# EAGLE design kirchhoff (EAGLE 9.6.2)
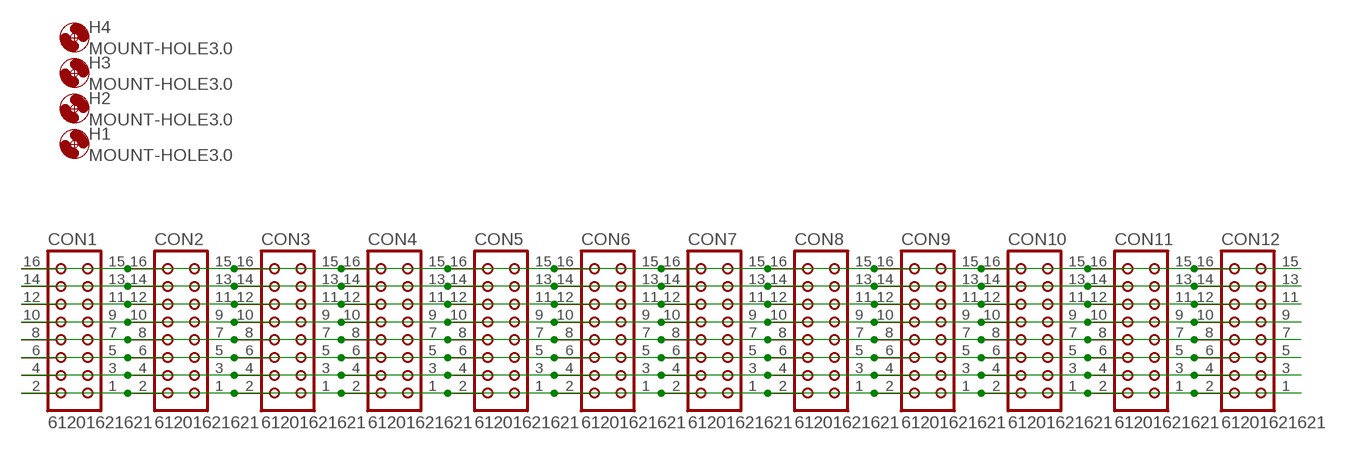
[diagram p0: schematic, sheet 1]

## Parts
CON1  61201621621  CON16L  [CON16L]
CON2  61201621621  CON16L  [CON16L]
CON3  61201621621  CON16L  [CON16L]
CON4  61201621621  CON16L  [CON16L]
CON5  61201621621  CON16L  [CON16L]
CON6  61201621621  CON16L  [CON16L]
CON7  61201621621  CON16L  [CON16L]
CON8  61201621621  CON16L  [CON16L]
CON9  61201621621  CON16L  [CON16L]
CON10  61201621621  CON16L  [CON16L]
CON11  61201621621  CON16L  [CON16L]
CON12  61201621621  CON16L  [CON16L]
H1  MOUNT-HOLE3.0  [3,0]
H2  MOUNT-HOLE3.0  [3,0]
H3  MOUNT-HOLE3.0  [3,0]
H4  MOUNT-HOLE3.0  [3,0]

## Nets
GND5: CON1.5 CON1.6 CON2.5 CON2.6 CON3.5 CON3.6 CON4.5 CON4.6 CON5.5 CON5.6 CON6.5 CON6.6 CON7.5 CON7.6 CON8.5 CON8.6 CON9.5 CON9.6 CON10.5 CON10.6 CON11.5 CON11.6 CON12.5 CON12.6
GND6: CON1.3 CON1.4 CON2.3 CON2.4 CON3.3 CON3.4 CON4.3 CON4.4 CON5.3 CON5.4 CON6.3 CON6.4 CON7.3 CON7.4 CON8.3 CON8.4 CON9.3 CON9.4 CON10.3 CON10.4 CON11.3 CON11.4 CON12.3 CON12.4
N$64: CON1.15 CON1.16 CON2.15 CON2.16 CON3.15 CON3.16 CON4.15 CON4.16 CON5.15 CON5.16 CON6.15 CON6.16 CON7.15 CON7.16 CON8.15 CON8.16 CON9.15 CON9.16 CON10.15 CON10.16 CON11.15 CON11.16 CON12.15 CON12.16
N$65: CON1.13 CON1.14 CON2.13 CON2.14 CON3.13 CON3.14 CON4.13 CON4.14 CON5.13 CON5.14 CON6.13 CON6.14 CON7.13 CON7.14 CON8.13 CON8.14 CON9.13 CON9.14 CON10.13 CON10.14 CON11.13 CON11.14 CON12.13 CON12.14
N$66: CON1.11 CON1.12 CON2.11 CON2.12 CON3.11 CON3.12 CON4.11 CON4.12 CON5.11 CON5.12 CON6.11 CON6.12 CON7.11 CON7.12 CON8.11 CON8.12 CON9.11 CON9.12 CON10.11 CON10.12 CON11.11 CON11.12 CON12.11 CON12.12
N$67: CON1.9 CON1.10 CON2.9 CON2.10 CON3.9 CON3.10 CON4.9 CON4.10 CON5.9 CON5.10 CON6.9 CON6.10 CON7.9 CON7.10 CON8.9 CON8.10 CON9.9 CON9.10 CON10.9 CON10.10 CON11.9 CON11.10 CON12.9 CON12.10
N$68: CON1.1 CON1.2 CON2.1 CON2.2 CON3.1 CON3.2 CON4.1 CON4.2 CON5.1 CON5.2 CON6.1 CON6.2 CON7.1 CON7.2 CON8.1 CON8.2 CON9.1 CON9.2 CON10.1 CON10.2 CON11.1 CON11.2 CON12.1 CON12.2
N$69: CON1.7 CON1.8 CON2.7 CON2.8 CON3.7 CON3.8 CON4.7 CON4.8 CON5.7 CON5.8 CON6.7 CON6.8 CON7.7 CON7.8 CON8.7 CON8.8 CON9.7 CON9.8 CON10.7 CON10.8 CON11.7 CON11.8 CON12.7 CON12.8

## Library data of the parts
CON1-CON12 = con-harting:CON16L: CONNECTOR; OC_FARNELL: unknown; OC_NEWARK: unknown
H1-H4 = holes:MOUNT-HOLE: MOUNTING HOLE with drill center marker

## Board
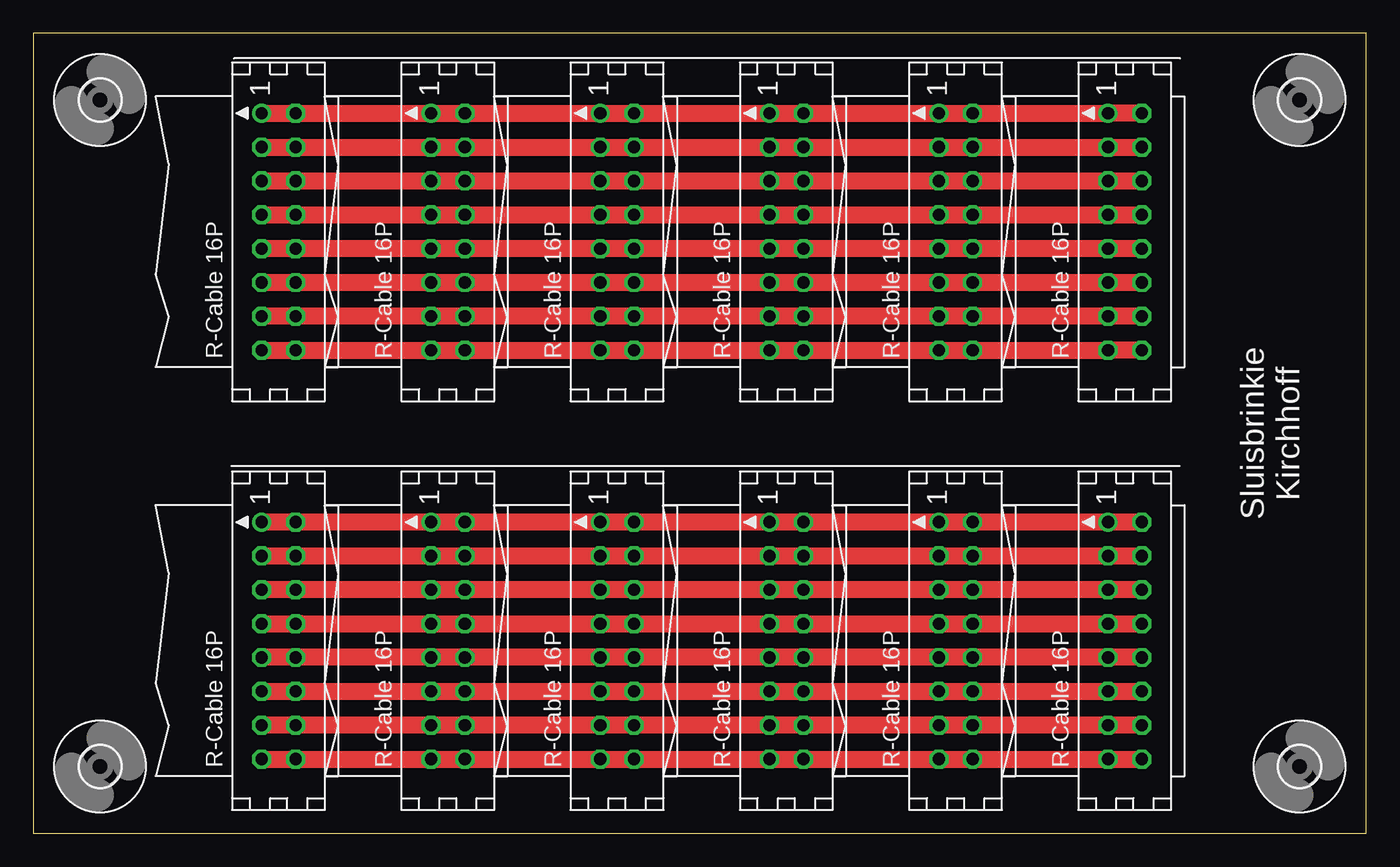
[diagram p1: board, top side]
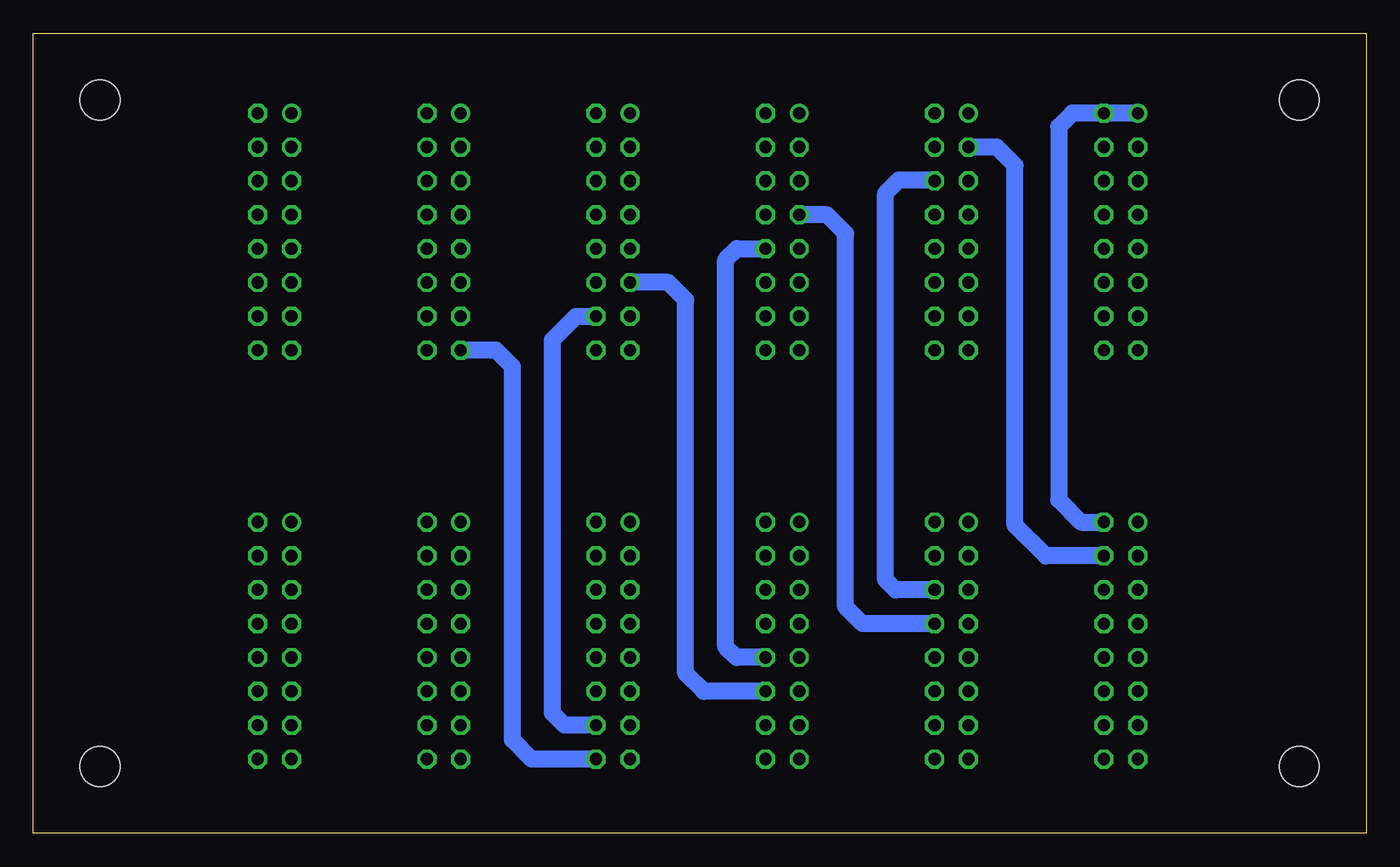
[diagram p2: board, bottom side, seen from below]

Size 100.02 x 60 mm. Coordinates in mm from the lower left corner, seen from the top.
Outline: 0,0 100.02,0 100.02,60 0,60 0,0
Copper layers (1*16): Top 0.035mm / dielectric 1.5mm / Bottom 0.035mm
Design rules "default *": minimum track width 6mil, minimum drill 0.35mm, track to track 6mil, track to pad 6mil, pad to pad 6mil, via to via 6mil, smd to smd 6mil, copper to edge 0.4mm, drill to drill 6mil, minimum pad ring 10mil, minimum via ring 8mil, stop-mask expansion 4mil, vias tented up to drill 0.35mm, thermal gap 10mil

### Footprints (pad centres in the part's own frame; a part is rotated, then mirrored left to right if it is on the bottom)
CON16L = drill 0.914: 1 8.89,1.27 | drill 0.914 octagon: 2 8.89,-1.27; 3 6.35,1.27; 4 6.35,-1.27; 5 3.81,1.27; 6 3.81,-1.27; 7 1.27,1.27; 8 1.27,-1.27; 9 -1.27,1.27; 10 -1.27,-1.27; 11 -3.81,1.27; 12 -3.81,-1.27; 13 -6.35,1.27; 14 -6.35,-1.27; 15 -8.89,1.27; 16 -8.89,-1.27
3,0 = hole 3: 0,0

### Placement (x,y rotation side)
CON1  18.41,45.12 90 top
CON2  31.11,45.12 90 top
CON3  18.41,14.45 90 top
CON4  31.11,14.45 90 top
CON5  43.81,45.12 90 top
CON6  43.81,14.45 90 top
CON7  56.51,45.12 90 top
CON8  56.51,14.45 90 top
CON9  69.21,45.12 90 top
CON10  69.21,14.45 90 top
CON11  81.91,45.12 90 top
CON12  81.91,14.45 90 top
H1  95.02,55 0 top
H2  95.02,5 0 top
H3  5.02,5 0 top
H4  5.02,55 0 top

### Tracks (layer width: path | path; a pad name or v marks a point on that pad's centre or on a via)
GND5
  Top 0.254: CON4.5 30.25,18.26
  Top 1.27: CON1.5 CON1.6 CON2.5 CON2.6 CON5.5 CON5.6 CON7.5 CON7.6 CON9.5 CON9.6 CON11.5 CON11.6 | CON3.5 CON3.6 30.25,18.26 CON4.6 CON6.5 CON6.6 CON8.5 CON8.6 CON10.5 CON10.6 CON12.5 CON12.6
  Bottom 1.27: 29.77,49 CON2.5 | CON4.6 35.32,18.26 36.06,19 36.06,48 35.06,49 32.45,49 CON2.6
GND6
  Top 1.27: CON1.3 CON1.4 CON2.3 CON2.4 CON5.3 CON5.4 CON7.3 CON7.4 CON9.3 CON9.4 CON11.3 CON11.4 | CON3.3 CON3.4 CON4.3 CON4.4 CON6.3 CON6.4 CON8.3 CON8.4 CON10.3 CON10.4 CON12.3 CON12.4
  Bottom 1.27: CON3.4 24.05,20.8 26.35,23.09 26.35,50.09 27.72,51.47 CON2.3
N$64
  Top 1.27: CON11.16 CON11.15 CON9.16 CON9.15 CON7.16 CON7.15 CON5.16 CON5.15 CON2.16 CON2.15 CON1.16 CON1.15 | CON3.15 CON3.16 CON4.15 CON4.16 CON6.15 CON6.16 CON8.15 CON8.16 CON10.15 CON10.16 CON12.15 CON12.16
  Bottom 1.27: CON8.16 62.62,5.56 64.06,7 64.06,35 65.29,36.23 CON9.15
N$65
  Top 1.27: CON11.14 CON11.13 CON9.14 CON9.13 CON7.14 CON7.13 CON5.14 CON5.13 CON2.14 CON2.13 CON1.14 CON1.13 | CON12.14 CON12.13 CON10.14 CON10.13 CON8.14 CON8.13 CON6.14 CON6.13 CON4.14 CON4.13 CON3.14 CON3.13
  Bottom 1.27: CON8.14 60.16,8.1 61.06,9 61.06,37 59.29,38.77 CON7.14
N$66
  Top 1.27: CON1.11 CON1.12 CON2.11 CON2.12 CON5.11 CON5.12 CON7.11 CON7.12 CON9.11 CON9.12 CON11.11 CON11.12 | CON3.11 CON3.12 CON4.11 CON4.12 CON6.11 CON6.12 CON8.11 CON8.12 CON10.11 CON10.12 CON12.11 CON12.12
  Bottom 1.27: CON6.12 49.7,10.64 51.06,12 51.06,40 52.37,41.31 CON7.11
N$67
  Top 1.27: CON11.10 CON11.9 CON9.10 CON9.9 CON7.10 CON7.9 CON5.10 CON5.9 CON2.10 CON2.9 CON1.10 CON1.9 | CON12.10 CON12.9 CON10.10 CON10.9 CON8.10 CON8.9 CON6.10 CON6.9 CON4.10 CON4.9 CON3.10 CON3.9
  Bottom 1.27: CON6.10 47.24,13.18 48.06,14 48.06,43 47.21,43.85 CON5.10
N$68
  Top 1.27: CON11.2 CON11.1 CON9.2 CON9.1 CON7.2 CON7.1 CON5.2 CON5.1 CON2.2 CON2.1 CON1.2 CON1.1 | CON12.2 CON12.1 CON10.2 CON10.1 CON8.2 CON8.1 CON6.2 CON6.1 CON4.2 CON4.1 CON3.2 CON3.1
  Bottom 1.27: CON1.1 22.05,54.01 23.06,53 23.06,25 21.4,23.34 CON3.2
N$69
  Top 0.254: CON3.8 20.06,15.72
  Top 1.27: CON1.7 CON1.8 CON2.7 CON2.8 CON5.7 CON5.8 CON7.7 CON7.8 CON9.7 CON9.8 CON11.7 CON11.8 | CON3.7 20.06,15.72 CON4.7 CON4.8 CON6.7 CON6.8 CON8.7 CON8.8 CON10.7 CON10.8 CON12.7 CON12.8
  Bottom 1.27: CON4.8 37.78,15.72 39.06,17 39.06,45 40.45,46.39 CON5.7

### Text on the board
tPlace: Sluisbrinkie / Kirchhoff